# Altium schematic sheet Brduino-MCU1.SchDoc: BRDUINO
size A3; Organization: TDK Micronas; DocumentNumber: tbd; Revision: 0.00.001; SheetNumber: 3; SheetTotal: 4; Date: 8/14/2020; DrawnBy: Moerz; Engineer: Moerz
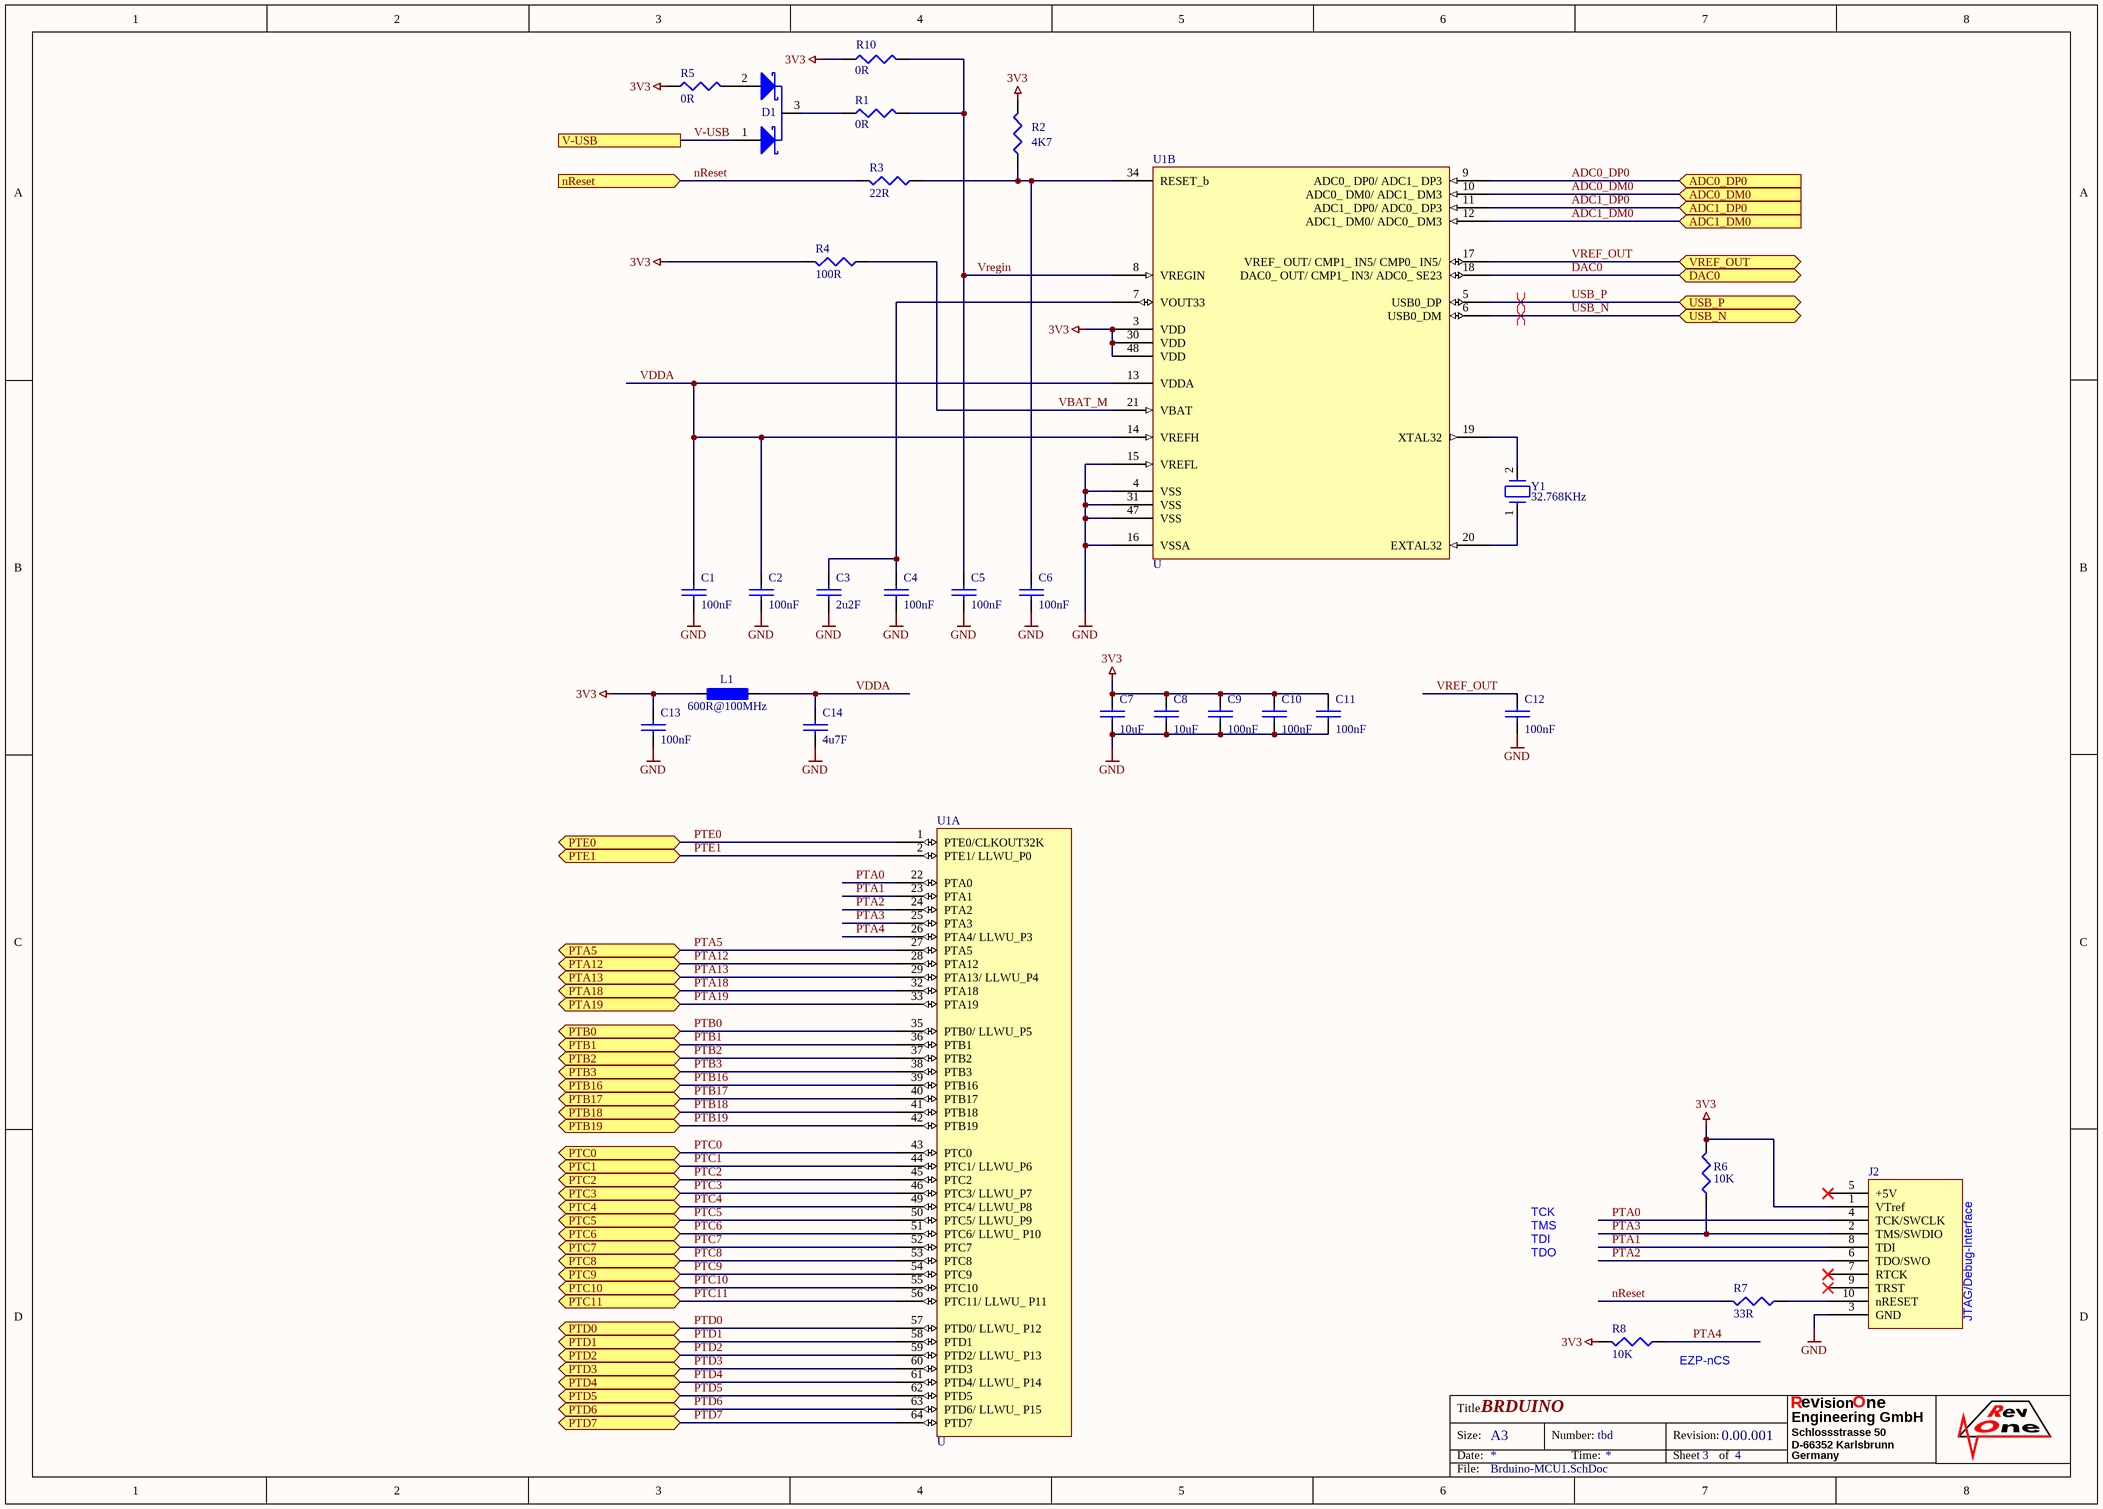
[diagram p0: Brduino-MCU1.SchDoc]

## Parts
C1  value 100nF  [C0402]  (hidden comment: C)
C2  value 100nF  [C0402]  (hidden comment: C)
C3  value 2u2F  [C0603]  (hidden comment: C)
C4  value 100nF  [C0402]  (hidden comment: C)
C5  value 100nF  [C0402]  (hidden comment: C)
C6  value 100nF  [C0402]  (hidden comment: C)
C7  value 10uF  [C0805]  (hidden comment: C)
C8  value 10uF  [C0805]  (hidden comment: C)
C9  value 100nF  [C0402]  (hidden comment: C)
C10  value 100nF  [C0402]  (hidden comment: C)
C11  value 100nF  [C0402]  (hidden comment: C)
C12  value 100nF  [C0402]  (hidden comment: C)
C13  value 100nF  [C0402]  (hidden comment: C)
C14  value 4u7F  [C0805]  (hidden comment: C)
D1  D  [SOT23]  (value not drawn)
J2  X  [JLINK-NEEDLE]  (value not drawn)  (no BOM)
L1  value 600R@100MHz  [L0805]  (hidden comment: L)
R1  value 0R  [R0402]  (hidden comment: R)
R2  value 4K7  [R0402]  (hidden comment: R)
R3  value 22R  [R0402]  (hidden comment: R)
R4  value 100R  [R0402]  (hidden comment: R)
R5  value 0R  [R0402]  (hidden comment: R)
R6  value 10K  [R0402]  (hidden comment: R)
R7  value 33R  [R0402]  (hidden comment: R)
R8  value 10K  [R0402]  (hidden comment: R)
R10  value 0R  [R0402]  (hidden comment: R)
U1  U  [NXP-SOT1699-1]  (parts A,B of 2)
Y1  value 32.768KHz  [CM7V-T1A]  (hidden comment: Y)

## Ports
ADC0_DM0 (in), ADC0_DP0 (in), ADC1_DM0 (in), ADC1_DP0 (in), DAC0 (bidir), nReset (in), PTA5 (bidir), PTA12 (bidir), PTA13 (bidir), PTA18 (bidir), PTA19 (bidir), PTB0 (bidir), PTB1 (bidir), PTB2 (bidir), PTB3 (bidir), PTB16 (bidir), PTB17 (bidir), PTB18 (bidir), PTB19 (bidir), PTC0 (bidir), PTC1 (bidir), PTC2 (bidir), PTC3 (bidir), PTC4 (bidir), PTC5 (bidir), PTC6 (bidir), PTC7 (bidir), PTC8 (bidir), PTC9 (bidir), PTC10 (bidir), PTC11 (bidir), PTD0 (bidir), PTD1 (bidir), PTD2 (bidir), PTD3 (bidir), PTD4 (bidir), PTD5 (bidir), PTD6 (bidir), PTD7 (bidir), PTE0 (bidir), PTE1 (bidir), USB_N (bidir), USB_P (bidir), V-USB, VREF_OUT (bidir)

## Nets
3V3: C7.1 C8.1 C9.1 C10.1 C11.1 C13.2 J2.1(VTref) L1.1 R2.2 R4.2 R5.1 R6.2 R8.2 R10.1 U1.3(VDD) U1.30(VDD) U1.48(VDD)
GND: C1.2 C2.2 C3.2 C4.2 C5.2 C6.2 C7.2 C8.2 C9.2 C10.2 C11.2 C12.2 C13.1 C14.1 J2.3(GND) U1.4(VSS) U1.15(VREFL) U1.16(VSSA) U1.31(VSS) U1.47(VSS)
ADC0_DM0: U1.10(ADC0__DM0/_ADC1__DM3) ; port ADC0_DM0
ADC0_DP0: U1.9(ADC0__DP0/_ADC1__DP3) ; port ADC0_DP0
ADC1_DM0: U1.12(ADC1__DM0/_ADC0__DM3) ; port ADC1_DM0
ADC1_DP0: U1.11(ADC1__DP0/_ADC0__DP3) ; port ADC1_DP0
DAC0: U1.18(DAC0__OUT/_CMP1__IN3/_ADC0__SE23) ; port DAC0
nReset: R3.2 R7.2 ; port nReset
PTA0: J2.4(TCK/SWCLK) U1.22(PTA0)
PTA1: J2.8(TDI) U1.23(PTA1)
PTA2: J2.6(TDO/SWO) U1.24(PTA2)
PTA3: J2.2(TMS/SWDIO) R6.1 U1.25(PTA3)
PTA4: R8.1 U1.26(PTA4/_LLWU_P3)
PTA5: U1.27(PTA5) ; port PTA5
PTA12: U1.28(PTA12) ; port PTA12
PTA13: U1.29(PTA13/_LLWU_P4) ; port PTA13
PTA18: U1.32(PTA18) ; port PTA18
PTA19: U1.33(PTA19) ; port PTA19
PTB0: U1.35(PTB0/_LLWU_P5) ; port PTB0
PTB1: U1.36(PTB1) ; port PTB1
PTB2: U1.37(PTB2) ; port PTB2
PTB3: U1.38(PTB3) ; port PTB3
PTB16: U1.39(PTB16) ; port PTB16
PTB17: U1.40(PTB17) ; port PTB17
PTB18: U1.41(PTB18) ; port PTB18
PTB19: U1.42(PTB19) ; port PTB19
PTC0: U1.43(PTC0) ; port PTC0
PTC1: U1.44(PTC1/_LLWU_P6) ; port PTC1
PTC2: U1.45(PTC2) ; port PTC2
PTC3: U1.46(PTC3/_LLWU_P7) ; port PTC3
PTC4: U1.49(PTC4/_LLWU_P8) ; port PTC4
PTC5: U1.50(PTC5/_LLWU_P9) ; port PTC5
PTC6: U1.51(PTC6/_LLWU__P10) ; port PTC6
PTC7: U1.52(PTC7) ; port PTC7
PTC8: U1.53(PTC8) ; port PTC8
PTC9: U1.54(PTC9) ; port PTC9
PTC10: U1.55(PTC10) ; port PTC10
PTC11: U1.56(PTC11/_LLWU__P11) ; port PTC11
PTD0: U1.57(PTD0/_LLWU__P12) ; port PTD0
PTD1: U1.58(PTD1) ; port PTD1
PTD2: U1.59(PTD2/_LLWU__P13) ; port PTD2
PTD3: U1.60(PTD3) ; port PTD3
PTD4: U1.61(PTD4/_LLWU__P14) ; port PTD4
PTD5: U1.62(PTD5) ; port PTD5
PTD6: U1.63(PTD6/_LLWU__P15) ; port PTD6
PTD7: U1.64(PTD7) ; port PTD7
PTE0: U1.1(PTE0/CLKOUT32K) ; port PTE0
PTE1: U1.2(PTE1/_LLWU_P0) ; port PTE1
USB_N: U1.6(USB0_DM) ; port USB_N
USB_P: U1.5(USB0_DP) ; port USB_P
V-USB: D1.1(A) ; port V-USB
VBAT_M: R4.1 U1.21(VBAT)
VDDA: C1.1 C2.1 C14.2 L1.2 U1.13(VDDA) U1.14(VREFH)
VREF_OUT: C12.1 U1.17(VREF__OUT/_CMP1__IN5/_CMP0__IN5/) ; port VREF_OUT
Vregin: C5.1 R1.2 R10.2 U1.8(VREGIN)
NetC3_1: C3.1 C4.1 U1.7(VOUT33)
NetC6_1: C6.1 R2.1 R3.1 U1.34(RESET_b)
NetD1_2: D1.2(K) R5.2
NetD1_3: D1.3(C) R1.1
NetJ2_10: J2.10(nRESET) R7.1
NetU1_19: U1.19(XTAL32) Y1.2
NetU1_20: U1.20(EXTAL32) Y1.1

Not connected (* = marked no-connect by the designer): J2 5(+5V)* 7(RTCK)* 9(TRST)*

## Layout directives
differential pair: USB_N, USB_P

## Notes on the sheet
- TCK
- TDI
- TDO
- TMS
- JTAG/Debug-Interface
- (near R8) EZP-nCS
- Title
- Size:
- Date:
- A3
- Number:
- Time:
- Revision:
- Sheet
- of
- R
- Schlossstrasse 50
- D-66352 Karlsbrunn
- Germany
- Engineering GmbH
- ev
- ision
- O
- ne
- File:

## Library data of the parts
C1 C2 C4-C6 C9-C13 = CAP: CAP CER 0.1UF 25V X7R 0402; 04. Manufacturer: Yageo; 05. Manufacturer PN: CC0402KRX7R8BB104; POPULATED: yes; Parameters: X7R, 25V, 10%; 03. Unit Price: 0.08; 01. Distributor: DigiKey; 02. distributor PN: 311-2077-6-ND
C3 = CAP: CAP CER 2.2UF 10V X5R 0603; 04. Manufacturer: Samsung Electro-Mechanics; 05. Manufacturer PN: CL10A225KP8NNNC; POPULATED: yes; Parameters: X7R, 25V, 10%; 03. Unit Price: 0.08; 01. Distributor: DigiKey; 02. distributor PN: 1276-1085-6-ND
C7 C8 = CAP: CAP CER 10UF 10V X7R 0805; 04. Manufacturer: Murata Electronics; 05. Manufacturer PN: GRM21BR71A106KA73L; POPULATED: yes; Parameters: X7R, 25V, 10%; 03. Unit Price: 0.21; 01. Distributor: DigiKey; 02. distributor PN: 490-10516-6-ND
C14 = CAP: CAP CER 4.7UF 10V X7R 0805; 04. Manufacturer: Samsung Electro-Mechanics; 05. Manufacturer PN: CL21B475KPFNNNE; POPULATED: yes; Parameters: X7R, 25V, 10%; 03. Unit Price: 0.21; 01. Distributor: DigiKey; 02. distributor PN: 1276-2972-6-ND
D1 = DUALSDIODE-CC: DIODE ARRAY SCHOTTKY 30V SOT23-3; 04. Manufacturer: ONSEMI; 05. Manufacturer PN: BAT54C; POPULATED: yes; 03. Unit Price: 0.18; 01. Distributor: DigiKey; 02. distributor PN: BAT54CFSCT-ND
J2 = JLINK-NEEDLE: 01. Distributor: DigiKey
L1 = FERRITE: FERRITE BEAD 600 OHM 0805 1LN; 04. Manufacturer: WUERTH; 05. Manufacturer PN: 742792040; Parameters: Idc=2A, Rdc=0.15R; POPULATED: yes; 03. Unit Price: 0.18; 01. Distributor: DigiKey; 02. distributor PN: 732-1620-6-ND
R1 R5 R10 = RES1A: RES SMD 0 OHM JUMPER 1/16W 0402; 04. Manufacturer: Yageo; 05. Manufacturer PN: RC0402JR-070RL; POPULATED: yes; Parameters: 1/16W, 50V, 1%; 03. Unit Price: 0.08; 01. Distributor: DigiKey; 02. distributor PN: 311-0.0JRDKR-ND
R2 = RES1A: RES SMD 4.7K OHM 1% 1/16W 0402; 04. Manufacturer: Yageo; 05. Manufacturer PN: RC0402FR-074K7L; POPULATED: yes; Parameters: 1/16W, 50V, 1%; 03. Unit Price: 0.08; 01. Distributor: DigiKey; 02. distributor PN: 311-4.7KLRDKR-ND
R3 = RES1A: RES SMD 22 OHM 1% 1/16W 0402; 04. Manufacturer: Yageo; 05. Manufacturer PN: RC0402FR-0722RL; POPULATED: yes; Parameters: 1/16W, 50V, 1%; 03. Unit Price: 0.08; 01. Distributor: DigiKey; 02. distributor PN: 311-22.0LRDKR-ND
R4 = RES1A: RES SMD 100 OHM 1% 1/16W 0402; 04. Manufacturer: Yageo; 05. Manufacturer PN: RC0402FR-07100RL; POPULATED: yes; Parameters: 1/16W, 50V, 1%; 03. Unit Price: 0.08; 01. Distributor: DigiKey; 02. distributor PN: 311-100LRDKR-ND
R6 R8 = RES1A: RES SMD 10K OHM 1% 1/16W 0402; 04. Manufacturer: Yageo; 05. Manufacturer PN: RC0402FR-0710KL; POPULATED: yes; Parameters: 1/16W, 50V, 1%; 03. Unit Price: 0.08; 01. Distributor: DigiKey; 02. distributor PN: 311-10.0KLRDKR-ND
R7 = RES1A: RES SMD 33 OHM 1% 1/16W 0402; 04. Manufacturer: Yageo; 05. Manufacturer PN: RC0402FR-0733RL; POPULATED: yes; Parameters: 1/16W, 50V, 1%; 03. Unit Price: 0.08; 01. Distributor: DigiKey; 02. distributor PN: 311-33.0LRDKR-ND
U1 = MK22FN512VLH12: IC MCU 32BIT 512KB FLASH 64LQFP; 04. Manufacturer: NXP USA Inc.; POPULATED: yes; 03. Unit Price: 7.16; 01. Distributor: DigiKey; 05. Manufacturer PN: MK22FN512VLH12; 02. distributor PN: MK22FN512VLH12-ND
Y1 = CM7V-T1A: Crystals 32.768 kHz 9.0 pF +/-20 PPM; 04. Manufacturer: Micro Crystal; 05. Manufacturer PN: CM7V-T1A-32.768k-9pF-20PPM-TA-QA T3; POPULATED: yes; 03. Unit Price: 0.37; 01. Distributor: Mouser; 02. distributor PN: 428-201568-MG03